# Altium schematic sheet DDR4.SchDoc
size A3; SheetNumber: 4; SheetTotal: 6
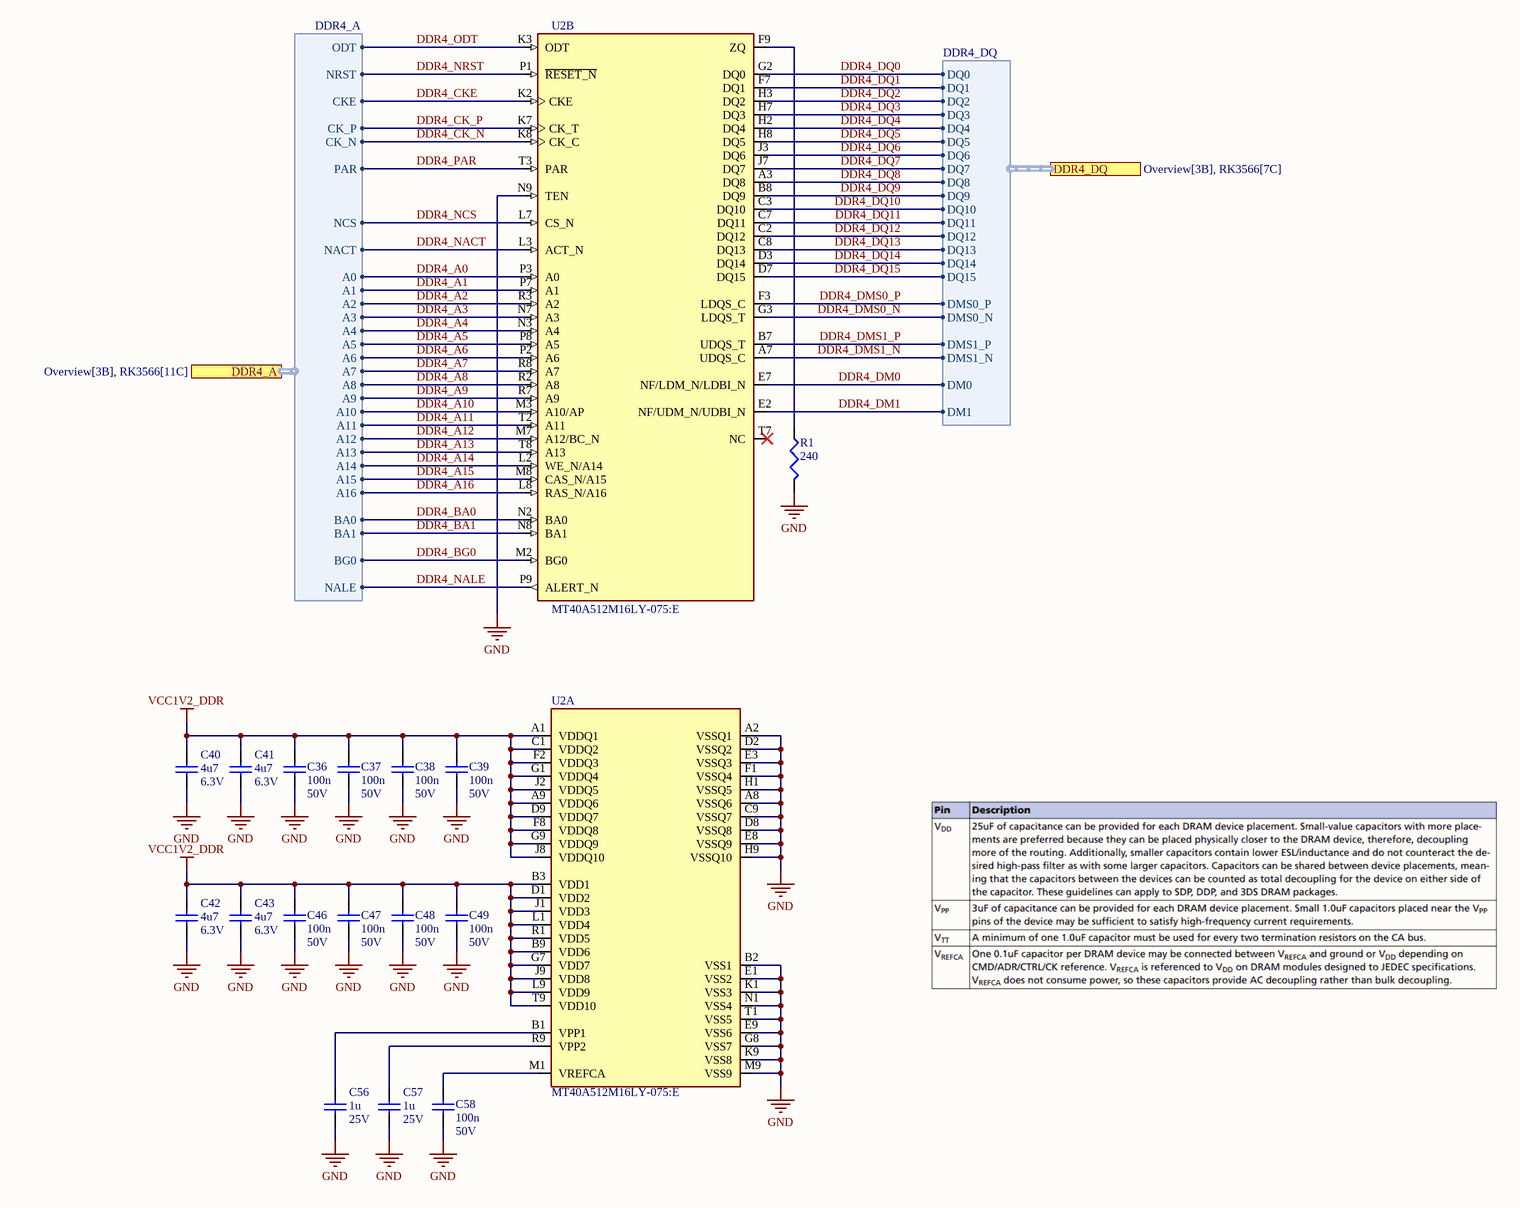
[diagram p0: DDR4.SchDoc]

## Parts
C36  value 100n  Voltage: 50V  [GRM155R71H104KE14D]  (hidden comment: GRM155R71H104KE14D)
C37  value 100n  Voltage: 50V  [GRM155R71H104KE14D]  (hidden comment: GRM155R71H104KE14D)
C38  value 100n  Voltage: 50V  [GRM155R71H104KE14D]  (hidden comment: GRM155R71H104KE14D)
C39  value 100n  Voltage: 50V  [GRM155R71H104KE14D]  (hidden comment: GRM155R71H104KE14D)
C40  value 4u7  Voltage: 6.3V  [GRM155R60J475ME47D]  (hidden comment: GRM155R60J475ME47D)
C41  value 4u7  Voltage: 6.3V  [GRM155R60J475ME47D]  (hidden comment: GRM155R60J475ME47D)
C42  value 4u7  Voltage: 6.3V  [GRM155R60J475ME47D]  (hidden comment: GRM155R60J475ME47D)
C43  value 4u7  Voltage: 6.3V  [GRM155R60J475ME47D]  (hidden comment: GRM155R60J475ME47D)
C46  value 100n  Voltage: 50V  [GRM155R71H104KE14D]  (hidden comment: GRM155R71H104KE14D)
C47  value 100n  Voltage: 50V  [GRM155R71H104KE14D]  (hidden comment: GRM155R71H104KE14D)
C48  value 100n  Voltage: 50V  [GRM155R71H104KE14D]  (hidden comment: GRM155R71H104KE14D)
C49  value 100n  Voltage: 50V  [GRM155R71H104KE14D]  (hidden comment: GRM155R71H104KE14D)
C56  value 1u  Voltage: 25V  [GRM155R61E105KA12D]  (hidden comment: GRM155R61E105KA12D)
C57  value 1u  Voltage: 25V  [GRM155R61E105KA12D]  (hidden comment: GRM155R61E105KA12D)
C58  value 100n  Voltage: 50V  [GRM155R71H104KE14D]  (hidden comment: GRM155R71H104KE14D)
R1  value 240  [RC0402FR-0718KL]  (hidden comment: RES 240)
U2  MT40A512M16LY-075:E  [MT40A512M16LY-075:E]  (parts A,B of 2)

## Ports
DDR4_A (harness DDR4_A, see Overview[3B], RK3566[11C]), DDR4_DQ (harness DDR4_DQ, see Overview[3B], RK3566[7C])

## Harnesses
DDR4_A: A0, A1, A2, A3, A4, A5, A6, A7, A8, A10, A9, A11, A13, A12, A14, A15, A16, BA0, ODT, NCS, PAR, NALE, NRST, CKE, CK_P, CK_N, NACT, BA1, BG0
DDR4_DQ: DQ0, DQ1, DQ2, DQ3, DQ4, DQ5, DQ6, DQ7, DQ8, DQ10, DQ9, DQ11, DQ13, DQ12, DQ14, DQ15, DMS0_P, DMS0_N, DMS1_N, DMS1_P, DM0, DM1

## Nets
GND: C36.2 C37.2 C38.2 C39.2 C40.2 C41.2 C42.2 C43.2 C46.2 C47.2 C48.2 C49.2 C56.2 C57.2 C58.2 R1.1 U2.A2(VSSQ1) U2.A8(VSSQ6) U2.B2(VSS1) U2.C9(VSSQ7) U2.D2(VSSQ2) U2.D8(VSSQ8) U2.E1(VSS2) U2.E3(VSSQ3) U2.E8(VSSQ9) U2.E9(VSS6) U2.F1(VSSQ4) U2.G8(VSS7) U2.H1(VSSQ5) U2.H9(VSSQ10) U2.K1(VSS3) U2.K9(VSS8) U2.M9(VSS9) U2.N1(VSS4) U2.N9(TEN) U2.T1(VSS5)
VCC1V2_DDR: C36.1 C37.1 C38.1 C39.1 C40.1 C41.1 C42.1 C43.1 C46.1 C47.1 C48.1 C49.1 U2.A1(VDDQ1) U2.A9(VDDQ6) U2.B3(VDD1) U2.B9(VDD6) U2.C1(VDDQ2) U2.D1(VDD2) U2.D9(VDDQ7) U2.F2(VDDQ3) U2.F8(VDDQ8) U2.G1(VDDQ4) U2.G7(VDD7) U2.G9(VDDQ9) U2.J1(VDD3) U2.J2(VDDQ5) U2.J8(VDDQ10) U2.J9(VDD8) U2.L1(VDD4) U2.L9(VDD9) U2.R1(VDD5) U2.T9(VDD10)
DDR4_A0: U2.P3(A0) ; port DDR4_A.A0
DDR4_A1: U2.P7(A1) ; port DDR4_A.A1
DDR4_A2: U2.R3(A2) ; port DDR4_A.A2
DDR4_A3: U2.N7(A3) ; port DDR4_A.A3
DDR4_A4: U2.N3(A4) ; port DDR4_A.A4
DDR4_A5: U2.P8(A5) ; port DDR4_A.A5
DDR4_A6: U2.P2(A6) ; port DDR4_A.A6
DDR4_A7: U2.R8(A7) ; port DDR4_A.A7
DDR4_A8: U2.R2(A8) ; port DDR4_A.A8
DDR4_A9: U2.R7(A9) ; port DDR4_A.A9
DDR4_A10: U2.M3(A10/AP) ; port DDR4_A.A10
DDR4_A11: U2.T2(A11) ; port DDR4_A.A11
DDR4_A12: U2.M7(A12/BC_N) ; port DDR4_A.A12
DDR4_A13: U2.T8(A13) ; port DDR4_A.A13
DDR4_A14: U2.L2(WE_N/A14) ; port DDR4_A.A14
DDR4_A15: U2.M8(CAS_N/A15) ; port DDR4_A.A15
DDR4_A16: U2.L8(RAS_N/A16) ; port DDR4_A.A16
DDR4_BA0: U2.N2(BA0) ; port DDR4_A.BA0
DDR4_BA1: U2.N8(BA1) ; port DDR4_A.BA1
DDR4_BG0: U2.M2(BG0) ; port DDR4_A.BG0
DDR4_CK_N: U2.K8(CK_C) ; port DDR4_A.CK_N
DDR4_CK_P: U2.K7(CK_T) ; port DDR4_A.CK_P
DDR4_CKE: U2.K2(CKE) ; port DDR4_A.CKE
DDR4_DM0: U2.E7(NF/LDM_N/LDBI_N) ; port DDR4_DQ.DM0
DDR4_DM1: U2.E2(NF/UDM_N/UDBI_N) ; port DDR4_DQ.DM1
DDR4_DMS0_N: U2.G3(LDQS_T) ; port DDR4_DQ.DMS0_N
DDR4_DMS0_P: U2.F3(LDQS_C) ; port DDR4_DQ.DMS0_P
DDR4_DMS1_N: U2.A7(UDQS_C) ; port DDR4_DQ.DMS1_N
DDR4_DMS1_P: U2.B7(UDQS_T) ; port DDR4_DQ.DMS1_P
DDR4_DQ0: U2.G2(DQ0) ; port DDR4_DQ.DQ0
DDR4_DQ1: U2.F7(DQ1) ; port DDR4_DQ.DQ1
DDR4_DQ2: U2.H3(DQ2) ; port DDR4_DQ.DQ2
DDR4_DQ3: U2.H7(DQ3) ; port DDR4_DQ.DQ3
DDR4_DQ4: U2.H2(DQ4) ; port DDR4_DQ.DQ4
DDR4_DQ5: U2.H8(DQ5) ; port DDR4_DQ.DQ5
DDR4_DQ6: U2.J3(DQ6) ; port DDR4_DQ.DQ6
DDR4_DQ7: U2.J7(DQ7) ; port DDR4_DQ.DQ7
DDR4_DQ8: U2.A3(DQ8) ; port DDR4_DQ.DQ8
DDR4_DQ9: U2.B8(DQ9) ; port DDR4_DQ.DQ9
DDR4_DQ10: U2.C3(DQ10) ; port DDR4_DQ.DQ10
DDR4_DQ11: U2.C7(DQ11) ; port DDR4_DQ.DQ11
DDR4_DQ12: U2.C2(DQ12) ; port DDR4_DQ.DQ12
DDR4_DQ13: U2.C8(DQ13) ; port DDR4_DQ.DQ13
DDR4_DQ14: U2.D3(DQ14) ; port DDR4_DQ.DQ14
DDR4_DQ15: U2.D7(DQ15) ; port DDR4_DQ.DQ15
DDR4_NACT: U2.L3(ACT_N) ; port DDR4_A.NACT
DDR4_NALE: U2.P9(ALERT_N) ; port DDR4_A.NALE
DDR4_NCS: U2.L7(CS_N) ; port DDR4_A.NCS
DDR4_NRST: U2.P1(~{RESET_N}) ; port DDR4_A.NRST
DDR4_ODT: U2.K3(ODT) ; port DDR4_A.ODT
DDR4_PAR: U2.T3(PAR) ; port DDR4_A.PAR
NetC56_1: C56.1 U2.B1(VPP1)
NetC57_1: C57.1 U2.R9(VPP2)
NetC58_1: C58.1 U2.M1(VREFCA)
NetR1_2: R1.2 U2.F9(ZQ)

Not connected (* = marked no-connect by the designer): U2 T7(NC)*

## Library data of the parts
C36-C39 C46-C49 C58 = GRM155R71H104KE14D: CAP 100N 50V X7R 0402; Size: 0402; Dielectric: X7R; Manufacturer Part Number 1: GRM155R71H104KE14D
C40-C43 = GRM155R60J475ME47D: CAP 4.7U 6.3V X5R 0402; Size: 0402; Dielectric: X5R; Manufacturer Part Number 1: GRM155R60J475ME47D
C56 C57 = GRM155R61E105KA12D: CAP 1U 25V X5R 0402; Size: 0402; Dielectric: X5R; Manufacturer Part Number 1: GRM155R61E105KA12D
R1 = RES 240: RES 240 1% 62.5mW 0402; Size: 0402; Manufacturer Part Number 1: RC0402FR-0718KL
U2 = MT40A512M16LY-075:E: SDRAM - DDR4 Memory IC 8Gb (512M x 16) Parallel 1.33 GHz 96-FBGA (7.5x13.5); MF: Micron Technology Inc.; SnapEDA_Link: https://www.snapeda.com/parts/MT40A512M16LY-075:E/Micron/view-part/?ref=snap; Package: TFBGA-96 Micron Technology; Value: *; MP: MT40A512M16LY-075:E; Check_prices: https://www.snapeda.com/parts/MT40A512M16LY-075:E/Micron/view-part/?ref=eda